# Altium schematic sheet Microcontroller.SchDoc
size A3; SheetNumber: 2; SheetTotal: 9
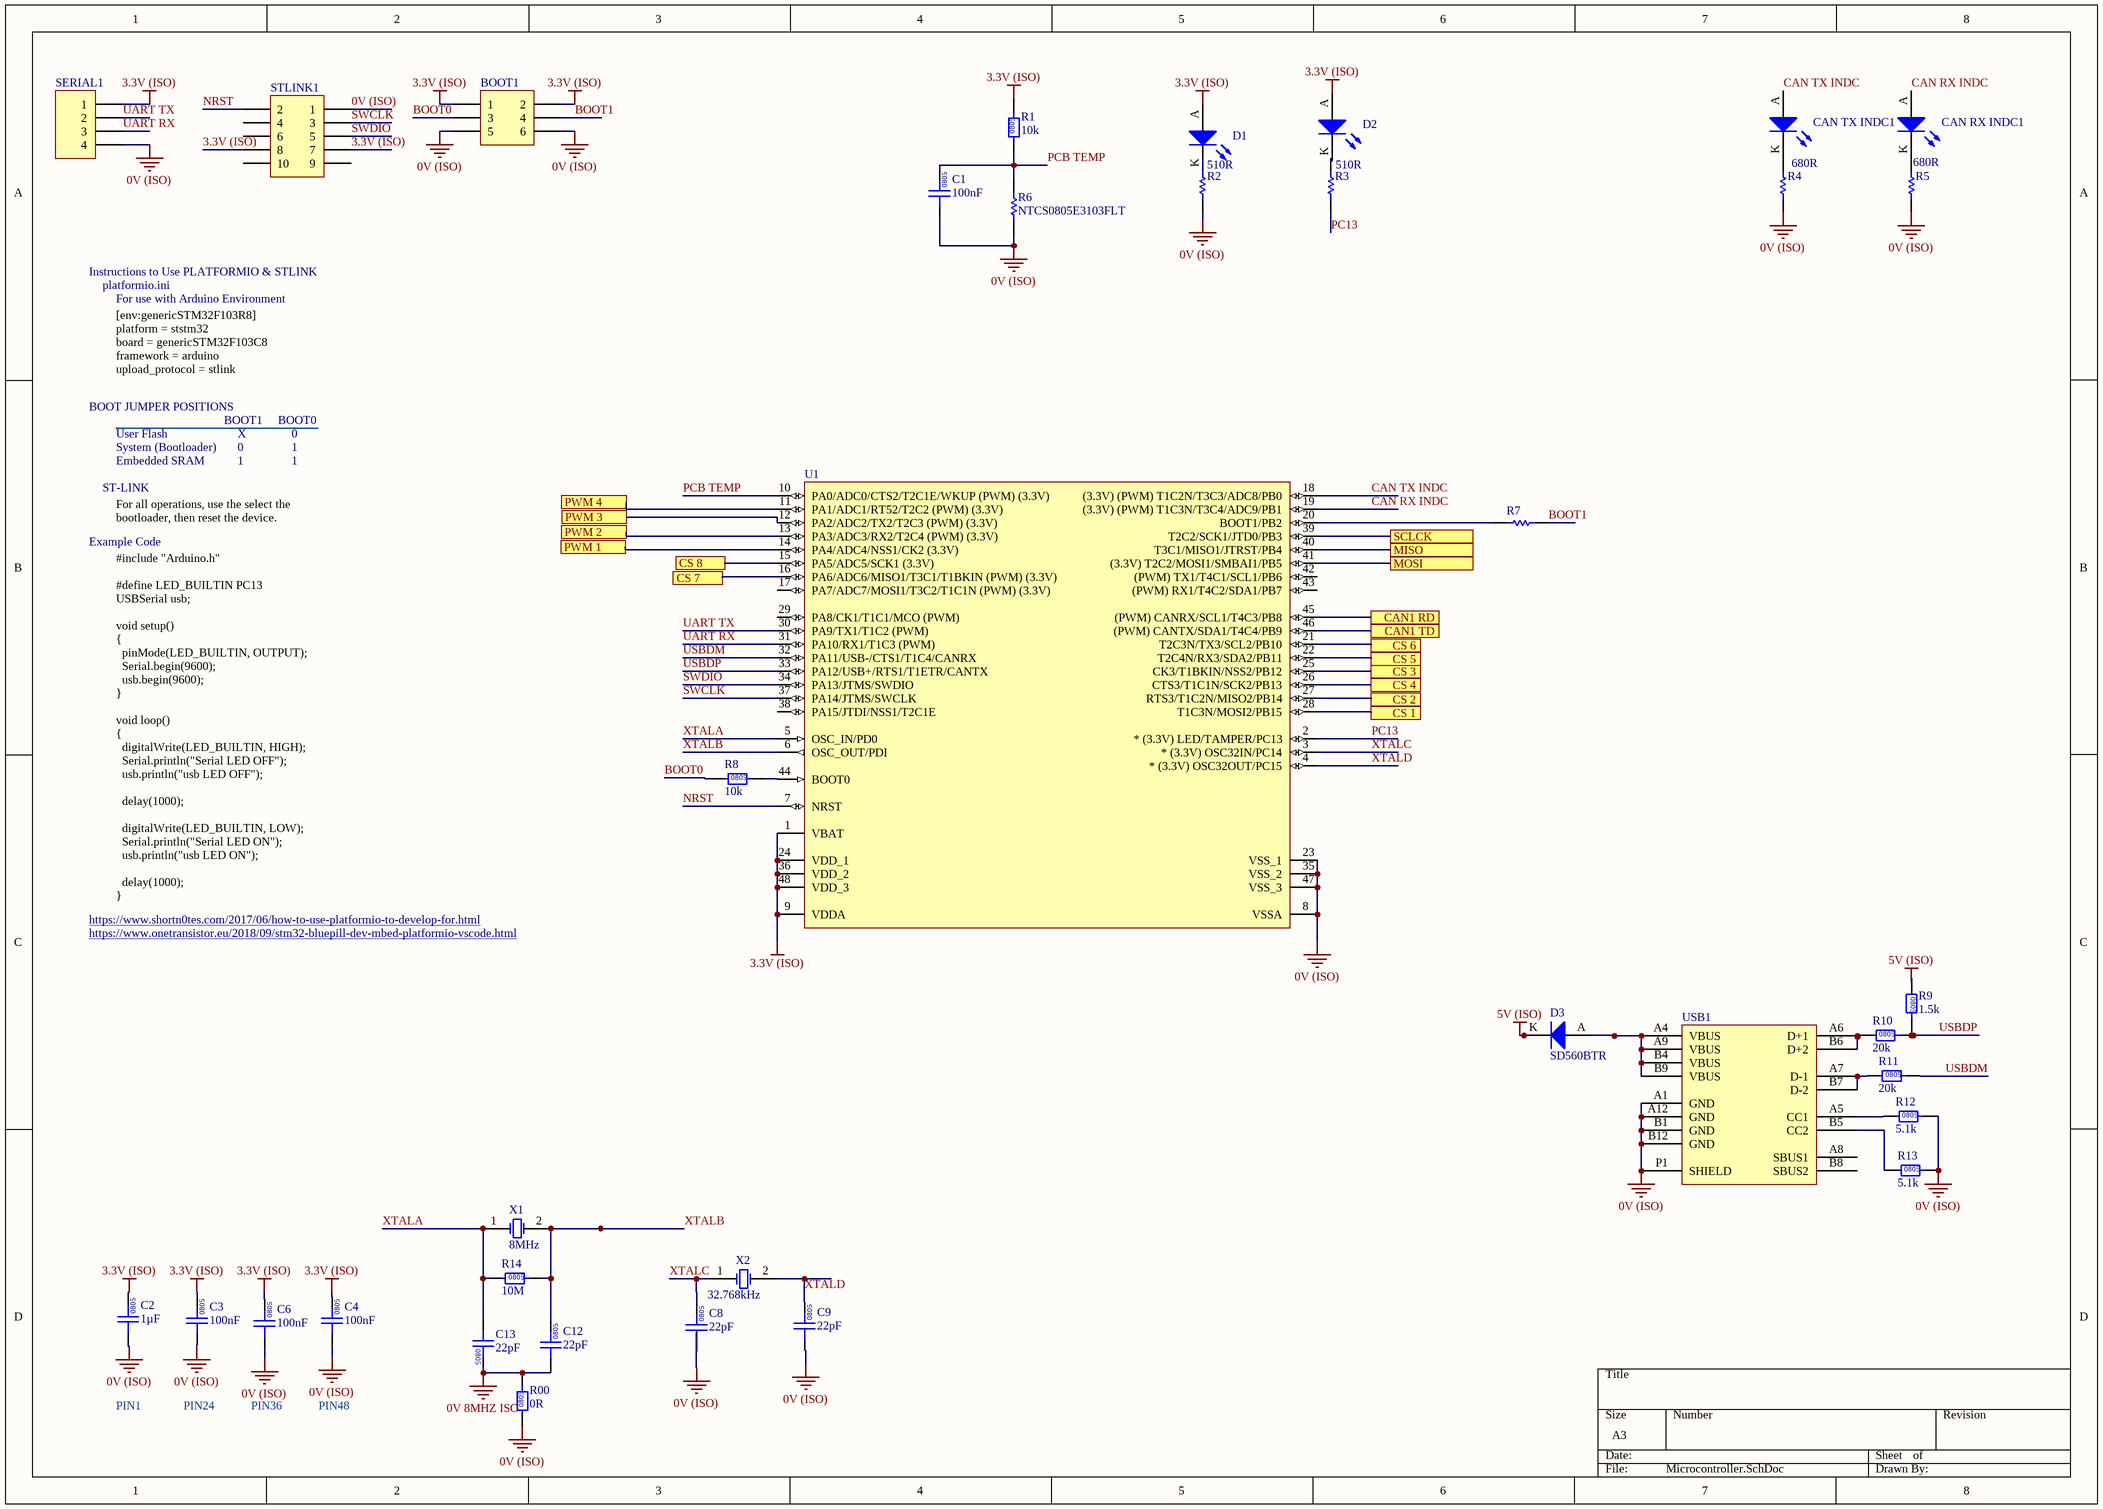
[diagram p0: Microcontroller.SchDoc]

## Parts
BOOT1  (no value)  [TH 2.54mm Header 2x3]
C1  100nF  [0805]
C2  1µF  [0805]
C3  100nF  [0805]
C4  100nF  [0805]
C6  100nF  [0805]
C8  22pF  [0805]
C9  22pF  [0805]
C12  22pF  [0805]
C13  22pF  [0805]
CAN_RX_INDC1  (no value)  [0805 LED]
CAN_TX_INDC1  (no value)  [0805 LED]
D1  (no value)  [0805 LED]
D2  (no value)  [0805 LED]
D3  SD560BTR  [SMB Diode]
R00  0R  [0805]
R1  10k  [0805]
R2  value 510R  [0805]
R3  value 510R  [0805]
R4  value 680R  [0805]
R5  value 680R  [0805]
R6  NTCS0805E3103FLT  [0805]
R7  (no value)  [0805]
R8  10k  [0805]
R9  1.5k  [0805]
R10  20k  [0805]
R11  20k  [0805]
R12  5.1k  [0805]
R13  5.1k  [0805]
R14  10M  [0805]
SERIAL1  (no value)  [TH 2.54mm Header 1x4]
STLINK1  (no value)  [TH 2.54mm Header 2x5]
U1  (no value)  [STM 48-LQFP]
USB1  (no value)  [USB4085-GF-A]
X1  8MHz  [Abracon HC-49/US]
X2  value 32.768kHz  [EPSON 2-SMD]

## Ports
CAN1 RD, CAN1 TD, CS 1, CS 2, CS 3, CS 4, CS 5, CS 6, CS 7, CS 8, MISO, MOSI, PWM 1, PWM 2, PWM 3, PWM 4, SCLCK

## Nets
0V 8MHZ ISO: C12.1 C13.2 R00.2
0V (ISO): BOOT1.5 BOOT1.6 C1.1 C2.1 C3.1 C4.1 C6.1 C8.1 C9.1 R00.1 R2.1 R4.1 R5.1 R6.1 R12.2 R13.2 SERIAL1.4 STLINK1.1 U1.8(VSSA) U1.23(VSS_1) U1.35(VSS_2) U1.47(VSS_3) USB1.A1(GND) USB1.A12(GND) USB1.B1(GND) USB1.B12(GND) USB1.P1(SHIELD)
3.3V (ISO): BOOT1.1 BOOT1.2 C2.2 C3.2 C4.2 C6.2 D1.A D2.A R1.2 SERIAL1.1 STLINK1.7 STLINK1.8 U1.1(VBAT) U1.9(VDDA) U1.24(VDD_1) U1.36(VDD_2) U1.48(VDD_3)
5V (ISO): D3.K R9.1
BOOT0: BOOT1.3 R8.1
BOOT1: BOOT1.4 R7.2
CAN1 RD: U1.45((PWM)_CANRX/SCL1/T4C3/PB8) ; port CAN1 RD
CAN1 TD: U1.46((PWM)_CANTX/SDA1/T4C4/PB9) ; port CAN1 TD
CAN RX INDC: CAN_RX_INDC1.A U1.19((3.3V)_(PWM)_T1C3N/T3C4/ADC9/PB1)
CAN TX INDC: CAN_TX_INDC1.A U1.18((3.3V)_(PWM)_T1C2N/T3C3/ADC8/PB0)
CS 1: U1.28(T1C3N/MOSI2/PB15) ; port CS 1
CS 2: U1.27(RTS3/T1C2N/MISO2/PB14) ; port CS 2
CS 3: U1.25(CK3/T1BKIN/NSS2/PB12) ; port CS 3
CS 4: U1.26(CTS3/T1C1N/SCK2/PB13) ; port CS 4
CS 5: U1.22(T2C4N/RX3/SDA2/PB11) ; port CS 5
CS 6: U1.21(T2C3N/TX3/SCL2/PB10) ; port CS 6
CS 7: U1.16(PA6/ADC6/MISO1/T3C1/T1BKIN_(PWM)_(3.3V)) ; port CS 7
CS 8: U1.15(PA5/ADC5/SCK1_(3.3V)) ; port CS 8
MISO: U1.40(T3C1/MISO1/JTRST/PB4) ; port MISO
MOSI: U1.41((3.3V)_T2C2/MOSI1/SMBAI1/PB5) ; port MOSI
NRST: STLINK1.2 U1.7(NRST)
PC13: R3.1 U1.2(*_(3.3V)_LED/TAMPER/PC13)
PCB TEMP: C1.2 R1.1 R6.2 U1.10(PA0/ADC0/CTS2/T2C1E/WKUP_(PWM)_(3.3V))
PWM 1: U1.14(PA4/ADC4/NSS1/CK2_(3.3V)) ; port PWM 1
PWM 2: U1.13(PA3/ADC3/RX2/T2C4_(PWM)_(3.3V)) ; port PWM 2
PWM 3: U1.12(PA2/ADC2/TX2/T2C3_(PWM)_(3.3V)) ; port PWM 3
PWM 4: U1.11(PA1/ADC1/RT52/T2C2_(PWM)_(3.3V)) ; port PWM 4
SCLCK: U1.39(T2C2/SCK1/JTD0/PB3) ; port SCLCK
SWCLK: STLINK1.3 U1.37(PA14/JTMS/SWCLK)
SWDIO: STLINK1.5 U1.34(PA13/JTMS/SWDIO)
UART RX: SERIAL1.3 U1.31(PA10/RX1/T1C3_(PWM))
UART TX: SERIAL1.2 U1.30(PA9/TX1/T1C2_(PWM))
USBDM: R11.2 U1.32(PA11/USB-/CTS1/T1C4/CANRX)
USBDP: R9.2 R10.2 U1.33(PA12/USB+/RTS1/T1ETR/CANTX)
XTALA: C13.1 R14.1 U1.5(OSC_IN/PD0) X1.1(OSC1)
XTALB: C12.2 R14.2 U1.6(OSC_OUT/PDI) X1.2(OSC2)
XTALC: C8.2 U1.3(*_(3.3V)_OSC32IN/PC14) X2.1(OSC1)
XTALD: C9.2 U1.4(*_(3.3V)_OSC32OUT/PC15) X2.2(OSC2)
NetCAN_RX_INDC1_K: CAN_RX_INDC1.K R5.2
NetCAN_TX_INDC1_K: CAN_TX_INDC1.K R4.2
NetD1_K: D1.K R2.2
NetD2_K: D2.K R3.2
NetD3_A: D3.A USB1.A4(VBUS) USB1.A9(VBUS) USB1.B4(VBUS) USB1.B9(VBUS)
NetR7_1: R7.1 U1.20(BOOT1/PB2)
NetR8_2: R8.2 U1.44(BOOT0)
NetR10_1: R10.1 USB1.A6(D+1) USB1.B6(D+2)
NetR11_1: R11.1 USB1.A7(D-1) USB1.B7(D-2)
NetR12_1: R12.1 USB1.A5(CC1)
NetR13_1: R13.1 USB1.B5(CC2)

Not connected (* = marked no-connect by the designer): STLINK1 4 6 9 10; U1 17(PA7/ADC7/MOSI1/T3C2/T1C1N_(PWM)_(3.3V)) 29(PA8/CK1/T1C1/MCO_(PWM)) 38(PA15/JTDI/NSS1/T2C1E) 42((PWM)_TX1/T4C1/SCL1/PB6) 43((PWM)_RX1/T4C2/SDA1/PB7); USB1 A8(SBUS1) B8(SBUS2)

## Notes on the sheet
- Instructions to Use PLATFORMIO & STLINK
- platformio.ini
- For use with Arduino Environment
- BOOT JUMPER POSITIONS
- [env:genericSTM32F103R8]
  platform = ststm32
  board = genericSTM32F103C8
  framework = arduino
  upload_protocol = stlink
- User Flash
- System (Bootloader)
- BOOT1
- X
- 0
- BOOT0
- 1
- ST-LINK
- Embedded SRAM
- For all operations, use the select the bootloader, then reset the device.
- Example Code
- https://www.shortn0tes.com/2017/06/how-to-use-platformio-to-develop-for.html
- #include "Arduino.h"
  #define LED_BUILTIN PC13
  USBSerial usb;
  void setup()
  {
  pinMode(LED_BUILTIN, OUTPUT);
  Serial.begin(9600);
  usb.begin(9600);
  }
  void loop()
  {
  digitalWrite(LED_BUILTIN, HIGH);
  Serial.println("Serial LED OFF");
  usb.println("usb LED OFF");
  delay(1000);
  digitalWrite(LED_BUILTIN, LOW);
  Serial.println("Serial LED ON");
  usb.println("usb LED ON");
  delay(1000);
  }
- https://www.onetransistor.eu/2018/09/stm32-bluepill-dev-mbed-platformio-vscode.html
- PIN1
- PIN24
- PIN36
- PIN48
- (in symbol GCM21BR71H104KA37L) 0805
- (in symbol GCM21BR71H105KA03L) 0805
- (in symbol GRM21A5C2E220JW01D) 0805
- (in symbol RC0805FR070RL) 0805
- (in symbol RC0805FR071K5L) 0805
- (in symbol RC0805FR075K1L) 0805
- (in symbol RC0805FR0710KL) 0805
- (in symbol RC0805FR0710ML) 0805
- (in symbol RC0805FR0720KL) 0805

## Library data of the parts
BOOT1 = TH 2.54mm Header 2x3: Positions: 6; Pitch: 2.54mm; Angle: 0; Flange: No; Contact: NA; Part Number: TH 2.54mm Header 2x3; Row Spacing: 2.54mm
C1 C3 C4 C6 = GCM21BR71H104KA37L: Manufacturer: muRata; Rated Voltage: 50V; Tolerance: ±10%; Material: MLCC; Temperature Rating: X7R; Part Number: GCM21BR71H104KA37L; Value: 100nF; Digikey Part Number: 490-6064-1-ND
C2 = GCM21BR71H105KA03L: Manufacturer: muRata; Rated Voltage: 50V; Tolerance: ±10%; Material: MLCC; Temperature Rating: X7R; Part Number: GCM21BR71H105KA03L; Value: 1µF; Digikey Part Number: 490-10675-1-ND
C8 C9 C12 C13 = GRM21A5C2E220JW01D: Manufacturer: muRata; Rated Voltage: 250V; Tolerance: ±5%; Material: MLCC; Temperature Rating: C0G, NP0; Part Number: GRM21A5C2E220JW01D; Value: 22pF; Digikey Part Number: 490-5534-1-ND
CAN_RX_INDC1 CAN_TX_INDC1 = SML-MN2BCTT86C: LED BLUE CLEAR 2012 SMD; Manufacturer: ROHM Semiconductor; Part Number: SML-MN2BCTT86C; Colour: Blue; Digikey Part Number: 846-1207-1-ND; Digikey Link: https://www.digikey.com/product-detail/en/rohm-semiconductor/SMLMN2BCTT86C/846-1207-1-ND/6057239
D1 D2 = SML-210LTT86: Red LED Indication - Discrete 1.75V 0805 (2012 Metric); Manufacturer: ROHM Semiconductor; Part Number: SML-210LTT86; Colour: Red; Digikey Part Number: 511-1286-1-ND; Digikey Link: https://www.digikey.com/product-detail/en/rohm-semiconductor/SML-210LTT86/511-1286-1-ND/637099
D3 = SD560BTR: Manufacturer: SMC Diode Solutions; Forward Voltage: 1.2 V; Breakdown Voltage: 600 V; Part Number: SD560BTR; Digikey Part Number: 1655-1530-2-ND
R00 = RC0805FR070RL: Manufacturer: YAGEO; Tolerance: 0.01; Rated Power: 0.125W; Part Number: RC0805FR070RL; Value: 0R; Material: FR-07; Digikey Part Number: 311-0.0CRCT-ND
R1 R8 = RC0805FR0710KL: Manufacturer: YAGEO; Tolerance: 0.01; Rated Power: 0.125W; Part Number: RC0805FR0710KL; Value: 10k; Material: FR-07; Digikey Part Number: 311-10.0KCRCT-ND
R2 R3 = RC0805FR07510RL: Manufacturer: YAGEO; Tolerance: 0.01; Rated Voltage: 0.125W; Part Number: RC0805FR07510RL; Material: FR-07; Digikey Part Number: 311-510CRCT-ND
R4 R5 = RC0805FR07680RL: Manufacturer: YAGEO; Tolerance: 0.01; Rated Voltage: 0.125W; Part Number: RC0805FR07680RL; Material: FR-07; Digikey Part Number: 311-680CRCT-ND
R6 = CMP-037-000418-3: Tolerance: 0.01; Value: 10K (NTC) (B25/85 3430K); Rated Voltage: 210mW; Digikey Part Number: BC2733CT-ND
R7 = RC0805FR0710KL: Manufacturer: YAGEO; Value: 10k; Tolerance: 0.01; Rated Voltage: 0.125W; Part Number: RC0805FR0710KL; Material: FR-07; Digikey Part Number: 311-10.0KCRCT-ND
R9 = RC0805FR071K5L: Manufacturer: YAGEO; Tolerance: 0.01; Rated Power: 0.125W; Part Number: RC0805FR071K5L; Value: 1.5k; Material: FR-07; Digikey Part Number: 311-1.50KCRCT-ND
R10 R11 = RC0805FR0720KL: Manufacturer: YAGEO; Tolerance: 0.01; Rated Power: 0.125W; Part Number: RC0805FR0720KL; Value: 20k; Material: FR-07; Digikey Part Number: 311-20.0KCRCT-ND
R12 R13 = RC0805FR075K1L: Manufacturer: YAGEO; Tolerance: 0.01; Rated Power: 0.125W; Part Number: RC0805FR075K1L; Value: 5.1k; Material: FR-07; Digikey Part Number: 311-5.10KCRCT-ND
R14 = RC0805FR0710ML: Manufacturer: YAGEO; Tolerance: 0.01; Rated Power: 0.125W; Part Number: RC0805FR0710ML; Value: 10M; Material: FR-07; Digikey Part Number: 311-10.0MCRCT-ND
SERIAL1 = TH 2.54mm Header 1x4: Positions: 4; Pitch: 2.54mm; Angle: 0; Flange: No; Contact: NA; Part Number: TH 2.54mm Header 1x4; Row Spacing: 2.54mm
STLINK1 = TH 2.54mm Header 2x5: Positions: 10; Pitch: 2.54mm; Angle: 0; Flange: No; Contact: NA; Part Number: TH 2.54mm Header 2x5; Row Spacing: 2.54mm
U1 = STM32F103C8T6: ARM® Cortex®-M3 STM32F1 Microcontroller IC 32-Bit 72MHz 64KB (64K x 8) FLASH; Manufacturer: STMicroelectronics; Part Number: STM32F103C8T6; Digikey Part Number: 497-6063-ND; Digikey Link: https://www.digikey.com/product-detail/en/stmicroelectronics/STM32F103C8T6/497-6063-ND/1646338
USB1 = USB4085-GF-A: USB - C (Type - C) USB 2.0 Receptacle Connector 16 Position Through Hole, Right Angle; Angle: 90; Part Number: USB4085-GF-A; Digikey Part Number: 2073-USB4085-GF-ACT-ND; Digikey Link: https://www.digikey.ee/product-detail/en/gct/USB4085-GF-A/2073-USB4085-GF-ACT-ND/9859733
X1 = ABLS-8.000MHZ-B4-T: Manufacturer: Abracon LLC; Load Capacitance: 18pF; ESR: 80R; Part Number: ABLS-8.000MHZ-B4-T; Value: 8MHz; Digikey Part Number: 535-10212-2-ND; Digikey Link: https://www.digikey.com/product-detail/en/abracon-llc/ABLS-8.000MHZ-B4-T/535-10212-2-ND/2184155
X2 = FC-135 32.7680KA-A5: Manufacturer: EPSON; Load Capacitance: 12.5pF; ESR: 70k; Part Number: FC-135 32.7680KA-A5; Digikey Part Number: SER4103TR-ND; Digikey Link: https://www.digikey.com/product-detail/en/epson/FC-135-32.7680KA-A5/SER4103TR-ND/5259895